# Altium project 驱动PCB.PrjPCB
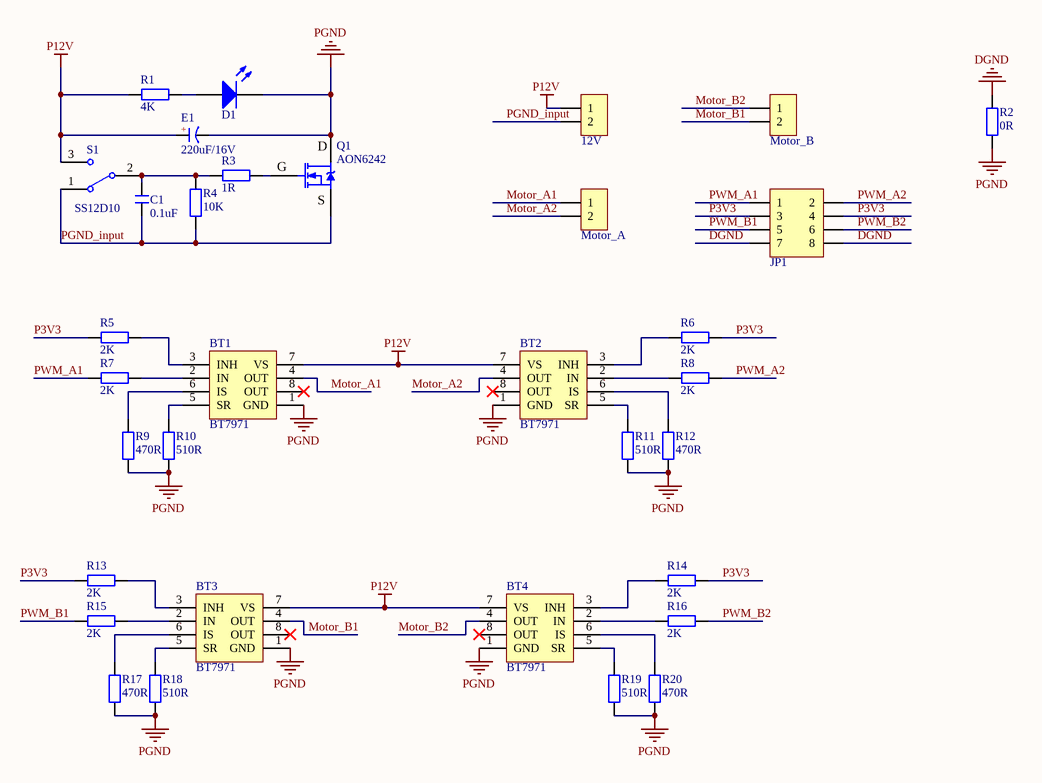
[diagram p0: 驱动开关.SchDoc]
1 sheet, 33 parts. Net scope: global (net labels, ports and power ports of the same name join across sheets).
Board file: 驱动板.PcbDoc

## Sheet 驱动开关.SchDoc
size A4

### Parts
12V  HDR-1X2  [KF301-5.0-2P]  (value not drawn)
BT1  BT7971  [TO263-7A]
BT2  BT7971  [TO263-7A]
BT3  BT7971  [TO263-7A]
BT4  BT7971  [TO263-7A]
C1  0.1uF  [C 0603_L]
D1  LED  [LED 0603B]  (value not drawn)
E1  220uF/16V  [CM D(6.3*7.7)]
JP1  Header 4X2  [HDR2.54-LI-2x4P]  (value not drawn)
Motor_A  HDR-1X2  [KF301-5.0-2P]  (value not drawn)
Motor_B  HDR-1X2  [KF301-5.0-2P]  (value not drawn)
Q1  AON6242  [AON6242]
R1  4K  [R 0603_L]
R2  0R  [R 0603_L]
R3  1R  [R 0603_L]
R4  10K  [R 0603_L]
R5  2K  [R 0603_L]
R6  2K  [R 0603_L]
R7  2K  [R 0603_L]
R8  2K  [R 0603_L]
R9  470R  [R 0603_L]
R10  510R  [R 0603_L]
R11  510R  [R 0603_L]
R12  470R  [R 0603_L]
R13  2K  [R 0603_L]
R14  2K  [R 0603_L]
R15  2K  [R 0603_L]
R16  2K  [R 0603_L]
R17  470R  [R 0603_L]
R18  510R  [R 0603_L]
R19  510R  [R 0603_L]
R20  470R  [R 0603_L]
S1  SS12D10  [SS-12D10]

### Nets
DGND: JP1.7 JP1.8 R2.2
P12V: 12V.1 BT1.7(VS) BT2.7(VS) BT3.7(VS) BT4.7(VS) E1.1(A) R1.2 S1.3
PGND: BT1.1(GND) BT2.1(GND) BT3.1(GND) BT4.1(GND) D1.2(K) E1.2(K) Q1.2(D) R2.1 R9.1 R10.1 R11.2 R12.2 R17.1 R18.1 R19.2 R20.2
Motor_A1: BT1.4(OUT) Motor_A.1
Motor_A2: BT2.4(OUT) Motor_A.2
Motor_B1: BT3.4(OUT) Motor_B.2
Motor_B2: BT4.4(OUT) Motor_B.1
P3V3: JP1.3 JP1.4 R5.1 R6.1 R13.1 R14.1
PGND_input: 12V.2 C1.1 Q1.3(S) R4.1 S1.1
PWM_A1: JP1.1 R7.1
PWM_A2: JP1.2 R8.1
PWM_B1: JP1.5 R15.1
PWM_B2: JP1.6 R16.1
NetBT1_2: BT1.2(IN) R7.2
NetBT1_3: BT1.3(INH) R5.2
NetBT1_5: BT1.5(SR) R10.2
NetBT1_6: BT1.6(IS) R9.2
NetBT2_2: BT2.2(IN) R8.2
NetBT2_3: BT2.3(INH) R6.2
NetBT2_5: BT2.5(SR) R11.1
NetBT2_6: BT2.6(IS) R12.1
NetBT3_2: BT3.2(IN) R15.2
NetBT3_3: BT3.3(INH) R13.2
NetBT3_5: BT3.5(SR) R18.2
NetBT3_6: BT3.6(IS) R17.2
NetBT4_2: BT4.2(IN) R16.2
NetBT4_3: BT4.3(INH) R14.2
NetBT4_5: BT4.5(SR) R19.1
NetBT4_6: BT4.6(IS) R20.1
NetC1_2: C1.2 R3.1 R4.2 S1.2
NetD1_1: D1.1(A) R1.1
NetQ1_1: Q1.1(G) R3.2

Not connected (* = marked no-connect by the designer): BT1 8(OUT)*; BT2 8(OUT)*; BT3 8(OUT)*; BT4 8(OUT)*

### Notes on the sheet
- (in symbol CE_SMD) +

### Library data of the parts
12V Motor_A Motor_B = Header 2: 2P接插件; 版权归属: 封装库来自淘宝 ID：黄晶宝石; 优秀评价可免费更新封装库: 联系淘宝ID：黄晶宝石，获取更新版封装库; 卖家免费技术支持，联系售后: 唯一出售店铺网址https://shop463601444.taobao.com; 封装库来自淘宝卖家 ID：黄晶宝石: 其他店铺购入均为盗版，请立即申请退款; BOM名称: 2P接插件
BT1-BT4 = BTN7971
C1 = C: 贴片电容; BOM名称: 无极性贴片电容; 封装库来自淘宝卖家 ID：黄晶宝石: 其他店铺购入均为盗版假冒封装库; 联系卖家，免费查找封装: 唯一出售店铺网址https://shop463601444.taobao.com
D1 = LED: 发光二极管; 封装库来自淘宝卖家 ID：黄晶宝石: 其他店铺购入均为假冒，请立即申请退款，本店奖励2~5元现金; 卖家免费查找封装，联系售后: 唯一出售店铺网址https://shop463601444.taobao.com
E1 = CE_SMD: 贴片电解电容; 封装库来自淘宝卖家 ID：黄晶宝石: 其他店铺购入均为盗版假冒封装库; 联系卖家，免费查找封装: 唯一出售店铺网址https://shop463601444.taobao.com; BOM名称: 贴片电解电容
JP1 = Header 4X2: 4*2P接插件; 封装库来自淘宝卖家  ID：黄晶宝石: 其他店铺购入均为盗版假冒封装库，请立即申请退款; 技术支持， 联系售后: 唯一出售店铺网址https://shop463601444.taobao.com; BOM名称: 4*2P接插件
Q1 = IRF3710: N沟场效应管; 封装库来自淘宝卖家 ID：黄晶宝石: 其他店铺购入均为假冒，请申请退款，本店现金奖励; 卖家免费查找封装，联系售后: 唯一出售店铺网址https://shop463601444.taobao.com; BOM名称: N沟场效应管
R1-R20 = R: 贴片电阻; 封装库来自淘宝卖家 ID：黄晶宝石: 其他店铺购入均为盗版假冒封装库; 联系卖家，免费查找封装: 唯一出售店铺网址https://shop463601444.taobao.com; BOM名称: 贴片电阻
S1 = MTS-10x: MTS10x系列3脚扭子开关; 免费技术支持，联系售后: 唯一出售店铺网址https://shop463601444.taobao.com; 封装库来自淘宝卖家 ID：黄晶宝石: 其他店铺购入均为盗版假冒封装库，请立即申请退款，本店3~10元现金奖励; BOM名称: MTS10x系列3脚扭子开关